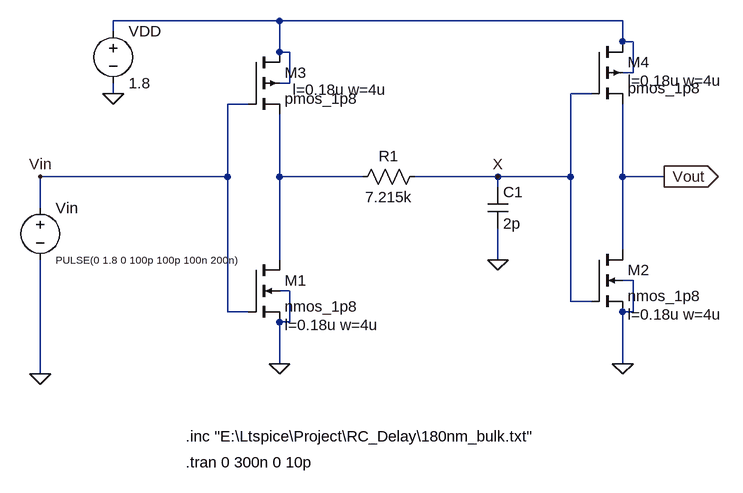
[diagram p0: schematic RC_Delay.asc]
RC_Delay.asc, the LTspice schematic file:
Version 4.1
SHEET 1 880 680
WIRE 144 -272 -112 -272
WIRE 672 -272 144 -272
WIRE -112 -256 -112 -272
WIRE 672 -240 672 -272
WIRE 688 -240 672 -240
WIRE 144 -224 144 -272
WIRE 160 -224 144 -224
WIRE 688 -192 688 -240
WIRE 688 -192 672 -192
WIRE 160 -176 160 -224
WIRE 160 -176 144 -176
WIRE -112 -160 -112 -176
WIRE 624 -160 592 -160
WIRE 96 -144 64 -144
WIRE 64 -32 64 -144
WIRE 64 -32 -224 -32
WIRE 144 -32 144 -128
WIRE 272 -32 144 -32
WIRE 480 -32 352 -32
WIRE 592 -32 592 -160
WIRE 592 -32 480 -32
WIRE 672 -32 672 -144
WIRE 736 -32 672 -32
WIRE 480 -16 480 -32
WIRE -224 16 -224 -32
WIRE 672 80 672 -32
WIRE 144 96 144 -32
WIRE 480 96 480 48
WIRE 688 128 672 128
WIRE 160 144 144 144
WIRE 592 160 592 -32
WIRE 624 160 592 160
WIRE 64 176 64 -32
WIRE 96 176 64 176
WIRE 672 176 672 160
WIRE 688 176 688 128
WIRE 688 176 672 176
WIRE 160 192 160 144
WIRE 160 192 144 192
WIRE 144 256 144 192
WIRE 672 256 672 176
WIRE -224 272 -224 96
FLAG 144 256 0
FLAG 672 256 0
FLAG -224 272 0
FLAG -112 -160 0
FLAG 480 96 0
FLAG -224 -32 Vin
FLAG 736 -32 Vout
IOPIN 736 -32 Out
FLAG 480 -32 X
SYMBOL nmos4 96 96 R0
WINDOW 123 56 100 Left 2
SYMATTR Value2 l=0.18u w=4u
SYMATTR InstName M1
SYMATTR Value nmos_1p8
SYMBOL nmos4 624 80 R0
WINDOW 123 56 100 Left 2
SYMATTR Value2 l=0.18u w=4u
SYMATTR InstName M2
SYMATTR Value nmos_1p8
SYMBOL pmos4 96 -224 R0
WINDOW 123 141 74 Bottom 2
SYMATTR Value2 l=0.18u w=4u
SYMATTR InstName M3
SYMATTR Value pmos_1p8
SYMBOL pmos4 624 -240 R0
WINDOW 123 56 60 Left 2
SYMATTR Value2 l=0.18u w=4u
SYMATTR InstName M4
SYMATTR Value pmos_1p8
SYMBOL res 368 -48 R90
WINDOW 0 0 56 VBottom 2
WINDOW 3 32 56 VTop 2
SYMATTR InstName R1
SYMATTR Value 7.215k
SYMBOL cap 464 -16 R0
SYMATTR InstName C1
SYMATTR Value 2p
SYMBOL voltage -224 0 R0
WINDOW 3 24 96 Left 1
WINDOW 123 0 0 Left 0
WINDOW 39 0 0 Left 0
SYMATTR Value PULSE(0 1.8 0 100p 100p 100n 200n)
SYMATTR InstName Vin
SYMBOL voltage -112 -272 R0
WINDOW 123 0 0 Left 0
WINDOW 39 0 0 Left 0
SYMATTR InstName VDD
SYMATTR Value 1.8
TEXT 0 368 Left 2 !.inc "E:\\Ltspice\\Project\\RC_Delay\\180nm_bulk.txt"
TEXT 0 408 Left 2 !.tran 0 300n 0 10p

The netlist it stands for:
* RC_Delay.asc
M1 N002 Vin 0 0 nmos_1p8 l=0.18u w=4u
M2 Vout X 0 0 nmos_1p8 l=0.18u w=4u
M3 N001 Vin N002 N001 pmos_1p8 l=0.18u w=4u
M4 N001 X Vout N001 pmos_1p8 l=0.18u w=4u
R1 X N002 7.215k
C1 X 0 2p
Vin Vin 0 PULSE(0 1.8 0 100p 100p 100n 200n)
VDD N001 0 1.8
.model NMOS NMOS
.model PMOS PMOS
.lib standard.mos
.inc "E:\Ltspice\Project\RC_Delay\180nm_bulk.txt"
.tran 0 300n 0 10p
.backanno
.end